# Altium schematic sheet BG1094_RPi3b+_Connector.SchDoc: =project_title
size Tabloid; CompanyName: Luxonis Holding; Organization: Luxonis Holding; Address1: 1925 Harmony Park Drive; Address2: Westminster, CO; Address3: 80234; Address4: United States; SheetNumber: 5; SheetTotal: 5
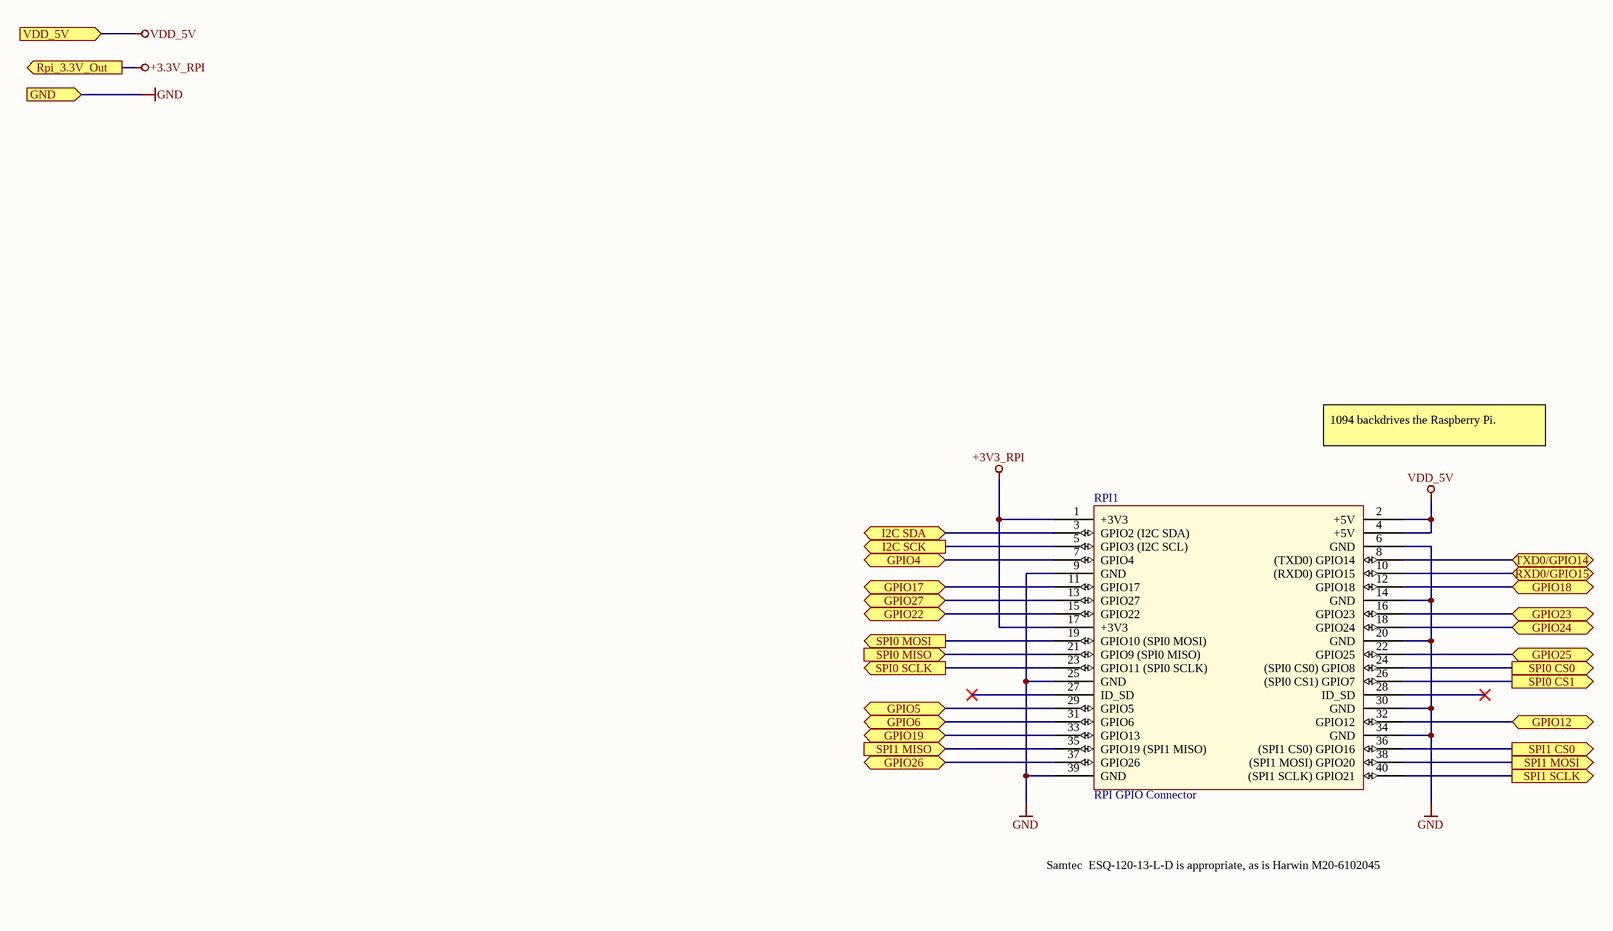
[diagram p0: BG1094_RPi3b+_Connector.SchDoc]

## Parts
RPI1  RPI GPIO Connector  [rpi-hat-40-socket]

## Ports
GND (in), GPIO4 (bidir), GPIO5 (bidir), GPIO6 (bidir), GPIO12 (bidir), GPIO17 (bidir), GPIO18 (bidir), GPIO19 (bidir), GPIO22 (bidir), GPIO23 (bidir), GPIO24 (bidir), GPIO25 (bidir), GPIO26 (bidir), GPIO27 (bidir), I2C SCK (out), I2C SDA (bidir), Rpi_3.3V_Out (out), RXD0/GPIO15 (bidir), SPI0 CS0 (out), SPI0 CS1 (out), SPI0 MISO (in), SPI0 MOSI (out), SPI0 SCLK (out), SPI1 CS0 (out), SPI1 MISO (in), SPI1 MOSI (out), SPI1 SCLK (out), TXD0/GPIO14 (bidir), VDD_5V (in)

## Nets
+3.3V_RPI: port Rpi_3.3V_Out
+3V3_RPI: RPI1.1(+3V3) RPI1.17(+3V3)
GND: RPI1.6(GND) RPI1.9(GND) RPI1.14(GND) RPI1.20(GND) RPI1.25(GND) RPI1.30(GND) RPI1.34(GND) RPI1.39(GND) ; port GND
VDD_5V: RPI1.2(+5V) RPI1.4(+5V) ; port VDD_5V
GPIO4: RPI1.7(GPIO4) ; port GPIO4
GPIO5: RPI1.29(GPIO5) ; port GPIO5
GPIO6: RPI1.31(GPIO6) ; port GPIO6
GPIO12: RPI1.32(GPIO12) ; port GPIO12
GPIO17: RPI1.11(GPIO17) ; port GPIO17
GPIO18: RPI1.12(GPIO18) ; port GPIO18
GPIO19: RPI1.33(GPIO13) ; port GPIO19
GPIO22: RPI1.15(GPIO22) ; port GPIO22
GPIO23: RPI1.16(GPIO23) ; port GPIO23
GPIO24: RPI1.18(GPIO24) ; port GPIO24
GPIO25: RPI1.22(GPIO25) ; port GPIO25
GPIO26: RPI1.37(GPIO26) ; port GPIO26
GPIO27: RPI1.13(GPIO27) ; port GPIO27
I2C SCK: RPI1.5(GPIO3_(I2C_SCL)) ; port I2C SCK
I2C SDA: RPI1.3(GPIO2_(I2C_SDA)) ; port I2C SDA
RXD0/GPIO15: RPI1.10((RXD0)_GPIO15) ; port RXD0/GPIO15
SPI0 CS0: RPI1.24((SPI0_CS0)_GPIO8) ; port SPI0 CS0
SPI0 CS1: RPI1.26((SPI0_CS1)_GPIO7) ; port SPI0 CS1
SPI0 MISO: RPI1.21(GPIO9_(SPI0_MISO)) ; port SPI0 MISO
SPI0 MOSI: RPI1.19(GPIO10_(SPI0_MOSI)) ; port SPI0 MOSI
SPI0 SCLK: RPI1.23(GPIO11_(SPI0_SCLK)) ; port SPI0 SCLK
SPI1 CS0: RPI1.36((SPI1_CS0)_GPIO16) ; port SPI1 CS0
SPI1 MISO: RPI1.35(GPIO19_(SPI1_MISO)) ; port SPI1 MISO
SPI1 MOSI: RPI1.38((SPI1_MOSI)_GPIO20) ; port SPI1 MOSI
SPI1 SCLK: RPI1.40((SPI1_SCLK)_GPIO21) ; port SPI1 SCLK
TXD0/GPIO14: RPI1.8((TXD0)_GPIO14) ; port TXD0/GPIO14

Not connected (* = marked no-connect by the designer): RPI1 27(ID_SD)* 28(ID_SD)*

## Notes on the sheet
- 1094 backdrives the Raspberry Pi.
- Samtec 	ESQ-120-13-L-D is appropriate, as is Harwin M20-6102045
- Title
- Size:
- Date:
- Tabloid
- Number:
- Time:
- Revision:
- Sheet
- of
- Drawn by:

## Library data of the parts
RPI1 = RPi HAT 40 Pin Connector: GPIO Header for Raspberry Pi A+/B+/Pi 2/Pi 3 - 2x20; nilsminor@web.de: mail; RoHS: RoHS Compliant; Category: Development Boards, Kits, Programmers; Stock 1: 150; Pricing 1: 1=1.84 (EUR); Part Status: Active; Accessory Type: Connector; For Use With/Related Products: Raspberry Pi; ComponentLink1URL: https://cdn.sparkfun.com/datasheets/Dev/RaspberryPi/12313.pdf; ComponentLink1Description: https://cdn.sparkfun.com/datasheets/Dev/RaspberryPi/12313.pdf